# Altium project iMag1_2.PrjPcb
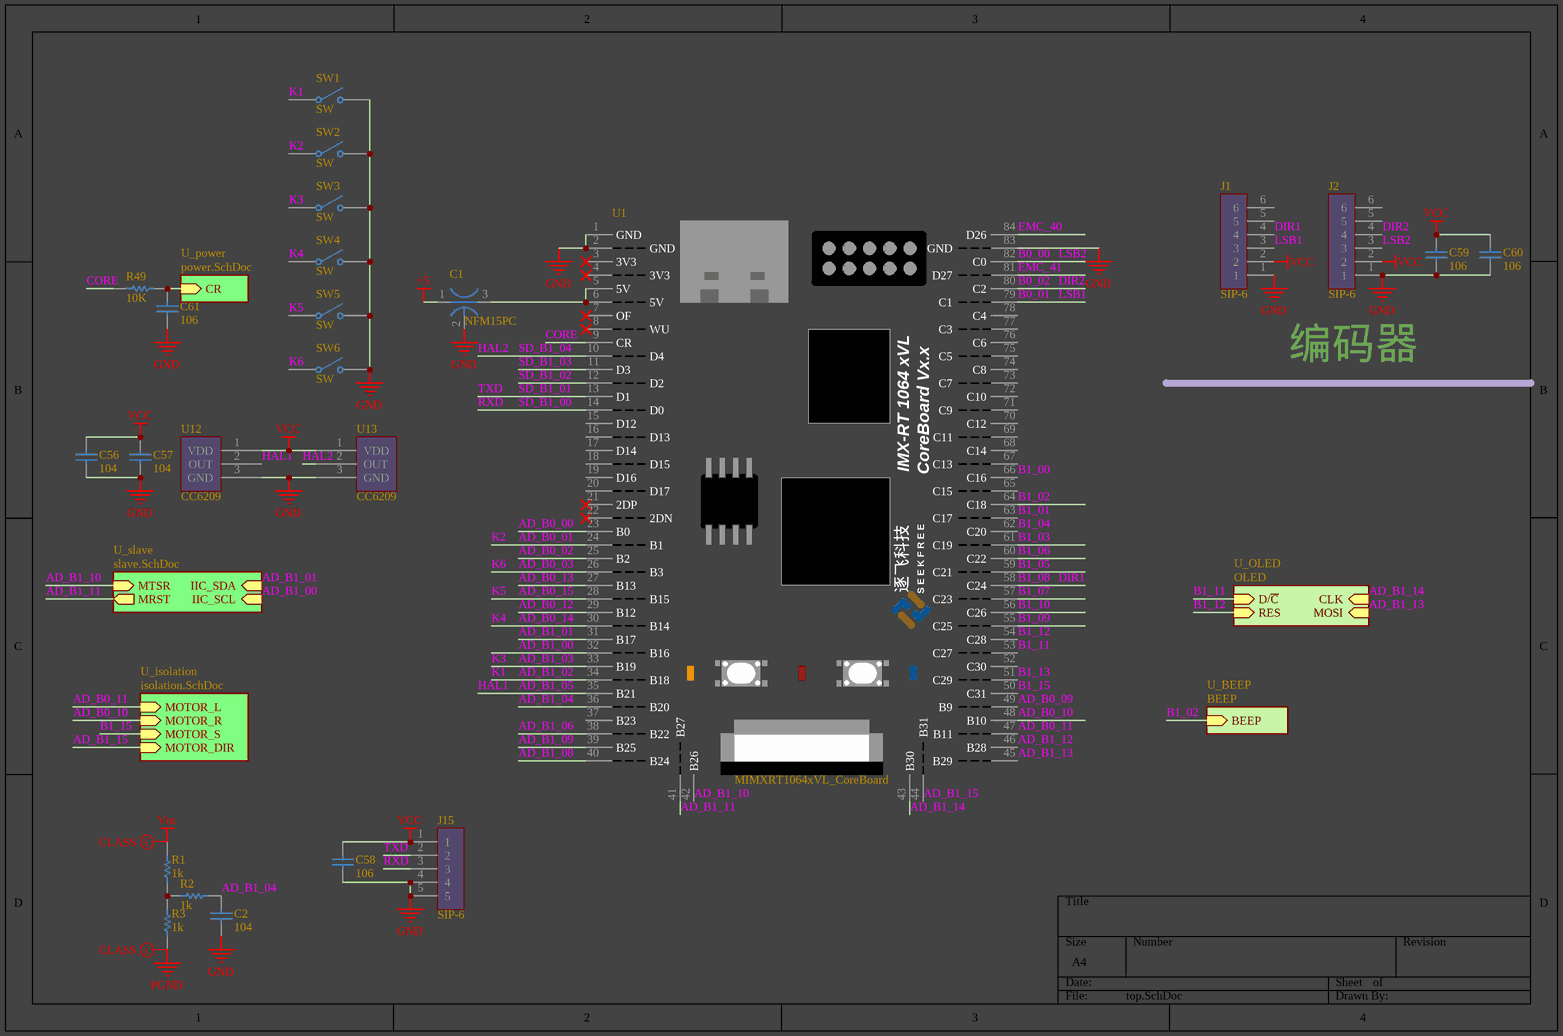
[diagram p0: top.SchDoc]
嘉立创: TRUE; 雕刻机: FALSE
5 sheets, 163 parts. Net scope: hierarchical (ports join the sheet entries above them; power ports are global).
Board file: pcb.PcbDoc
Sheets:
  top.SchDoc
    U_power = power.SchDoc
    U_slave = slave.SchDoc
      U_invert = invert.SchDoc
    U_isolation = isolation.SchDoc

## Sheet top.SchDoc
size A4; DocumentNumber: 1; SheetNumber: 1; SheetTotal: 9

### Parts
C1  NFM15PC  [FILTER-SMD_3P-L1.0-W0.5-L]
C2  104  [C0603]
C56  104  [C0603]
C57  104  [C0603]
C58  106  [C0603]
C59  106  [C0603]
C60  106  [C0603]
C61  106  [C0603]
J1  SIP-6  [2.54简易牛角座6P]
J2  SIP-6  [2.54简易牛角座6P]
J15  SIP-6  [2.54排针1X5]
R1  1k  [R0603]
R2  1k  [R0603]
R3  1k  [R0603]
R49  10K  [R0603]
SW1  SW  [KEY-SMD_4P-L4.2-W3.2-P2.20-LS4.6]
SW2  SW  [KEY-SMD_4P-L4.2-W3.2-P2.20-LS4.6]
SW3  SW  [KEY-SMD_4P-L4.2-W3.2-P2.20-LS4.6]
SW4  SW  [KEY-SMD_4P-L4.2-W3.2-P2.20-LS4.6]
SW5  SW  [KEY-SMD_4P-L4.2-W3.2-P2.20-LS4.6]
SW6  SW  [KEY-SMD_4P-L4.2-W3.2-P2.20-LS4.6]
U1  MIMXRT1064xVL_CoreBoard  [MIMXRT1064xVL_CoreBoard]
U12  CC6209  [SOT-23]
U13  CC6209  [SOT-23]

### Sub-sheets
U_BEEP = BEEP (file not in this document): BEEP (in)
U_isolation = isolation.SchDoc: MOTOR_L (in), MOTOR_R (in), MOTOR_S (in), MOTOR_DIR (in)
U_OLED = OLED (file not in this document): D/~{C} (in), RES (in), CLK (in), MOSI (in)
U_power = power.SchDoc: CR (in)
U_slave = slave.SchDoc: MTSR (in), MRST (out), IIC_SDA (in), IIC_SCL (in)

### Nets
+5: C1.1(IN)
GND: C1.2(GND) C2.1 C56.1 C57.1 C58.1 C59.1 C60.1 C61.1 J1.1 J2.1 J15.4 J15.5 SW1.2(NO) SW2.2(NO) SW3.2(NO) SW4.2(NO) SW5.2(NO) SW6.2(NO) U1.1(GND) U1.2(GND) U1.83(GND) U12.3(GND) U13.3(GND)
PGND: R3.1
VCC: C56.2 C57.2 C58.2 C59.2 C60.2 J1.2 J2.2 J15.1 U12.1(VDD) U13.1(VDD)
Vm: R1.2
AD_B0_00: U1.23(B0)
AD_B0_01: SW2.1(COMMON) U1.24(B1)  [also labelled K2]
AD_B0_02: U1.25(B2)
AD_B0_03: SW6.1(COMMON) U1.26(B3)  [also labelled K6]
AD_B0_09: U1.49(B9)
AD_B0_10: U1.48(B10) ; sheet U_isolation/MOTOR_R
AD_B0_11: U1.47(B11) ; sheet U_isolation/MOTOR_L
AD_B0_12: U1.29(B12)
AD_B0_13: U1.27(B13)
AD_B0_14: SW4.1(COMMON) U1.30(B14)  [also labelled K4]
AD_B0_15: SW5.1(COMMON) U1.28(B15)  [also labelled K5]
AD_B1_00: U1.32(B16) ; sheet U_slave/IIC_SCL
AD_B1_01: U1.31(B17) ; sheet U_slave/IIC_SDA
AD_B1_02: SW1.1(COMMON) U1.34(B18)  [also labelled K1]
AD_B1_03: SW3.1(COMMON) U1.33(B19)  [also labelled K3]
AD_B1_04: C2.2 R2.1 U1.36(B20)
AD_B1_05: U1.35(B21) U12.2(OUT)  [also labelled HAL1]
AD_B1_06: U1.38(B22)
AD_B1_08: U1.40(B24)
AD_B1_09: U1.39(B25)
AD_B1_10: U1.42(B26) ; sheet U_slave/MTSR
AD_B1_11: U1.41(B27) ; sheet U_slave/MRST
AD_B1_12: U1.46(B28)
AD_B1_13: U1.45(B29) ; sheet U_OLED/MOSI
AD_B1_14: U1.43(B30) ; sheet U_OLED/CLK
AD_B1_15: U1.44(B31) ; sheet U_isolation/MOTOR_DIR
B0_00: J2.3 U1.82(C0)  [also labelled LSB2]
B0_01: J1.3 U1.79(C1)  [also labelled LSB1]
B0_02: J2.4 U1.80(C2)  [also labelled DIR2]
B1_00: U1.66(C16)
B1_01: U1.63(C17)
B1_02: U1.64(C18) ; sheet U_BEEP/BEEP
B1_03: U1.61(C19)
B1_04: U1.62(C20)
B1_05: U1.59(C21)
B1_06: U1.60(C22)
B1_07: U1.57(C23)
B1_08: J1.4 U1.58(C24)  [also labelled DIR1]
B1_09: U1.55(C25)
B1_10: U1.56(C26)
B1_11: U1.53(C27) ; sheet U_OLED/D/~{C}
B1_12: U1.54(C28) ; sheet U_OLED/RES
B1_13: U1.51(C29)
B1_15: U1.50(C31) ; sheet U_isolation/MOTOR_S
CORE: R49.2 U1.9(CR)
CR: C61.2 R49.1 ; sheet U_power/CR
EMC_40: U1.84(D26)
EMC_41: U1.81(D27)
HAL2: U1.10(D4) U13.2(OUT)  [also labelled SD_B1_04]
RXD: J15.3 U1.14(D0)  [also labelled SD_B1_00]
SD_B1_01: J15.2 U1.13(D1)  [also labelled TXD]
SD_B1_02: U1.12(D2)
SD_B1_03: U1.11(D3)
NetC1_3: C1.3(OUT) U1.5(5V) U1.6(5V)
NetR1_1: R1.1 R2.2 R3.2

Not connected (* = marked no-connect by the designer): J1 5 6; J2 5 6; U1 3(3V3)* 4(3V3)* 7(OF)* 8(WU)* 15(D12) 16(D13) 17(D14) 18(D15) 19(D16) 20(D17) 21(2DP)* 22(2DN)* 37(B23) 52(C30) 65(C15) 67(C13) 68(C14) 69(C11) 70(C12) 71(C9) 72(C10) 73(C7) 74(C8) 75(C5) 76(C6) 77(C3) 78(C4)

### Layout directives
net class POW: Vm
net class GND: PGND

### Notes on the sheet
- 编码器
- Title
- Size:
- Date:
- A4
- Number:
- Time:
- Revision:
- Sheet
- of
- File:
- (in symbol MIMXRT1064xVL_CoreBoard) IMX-RT 1064 xVL; CoreBoard Vx.x; 逐飞科技; S E E K F R E E

### Library data of the parts
C1 = 陶瓷滤波器: BOM_Manufacturer: Murata Electronics; BOM_Manufacturer Part: NFM15PC473C1C3D; Capacitance: 47nF; Contributor: LCSC; BOM_Supplier: LCSC; BOM_Supplier Part: C162672; spicePre: U; spiceSymbolName: NFM15PC473C1C3D
C2 C56-C61 = 电容: Capacitor; Value: 22pF; Published: 8-Jun-2000; LatestRevisionDate: 17-Jul-2002; LatestRevisionNote: Re-released for DXP Platform.; PackageReference: RAD-0.3; Publisher: Altium Limited; PackageDescription: Radial Cap, Thru-Hole; 2 Leads; 0.3 in Pin Spacing
J15 = SIP-5
R1-R3 R49 = 电阻: Resistor; Value: 150R; Published: 8-Jun-2000; LatestRevisionDate: 17-Jul-2002; LatestRevisionNote: Re-released for DXP Platform.; PackageReference: AXIAL-0.3; Publisher: Altium Limited; PackageDescription: Axial Device, Thru-Hole; 2 Leads; 0.3 in Pin Spacing
SW1-SW6 = Switch: Single-Pole, Single-Throw Switch
U1 = MIMXRT1064xVL_CoreBoard: 逐飞科技i.MX RT1064核心板整体原理，可直接使用
U12 U13 = 霍尔开关

## Sheet power.SchDoc
size A4; DocumentNumber: 3; SheetNumber: 3; SheetTotal: 9
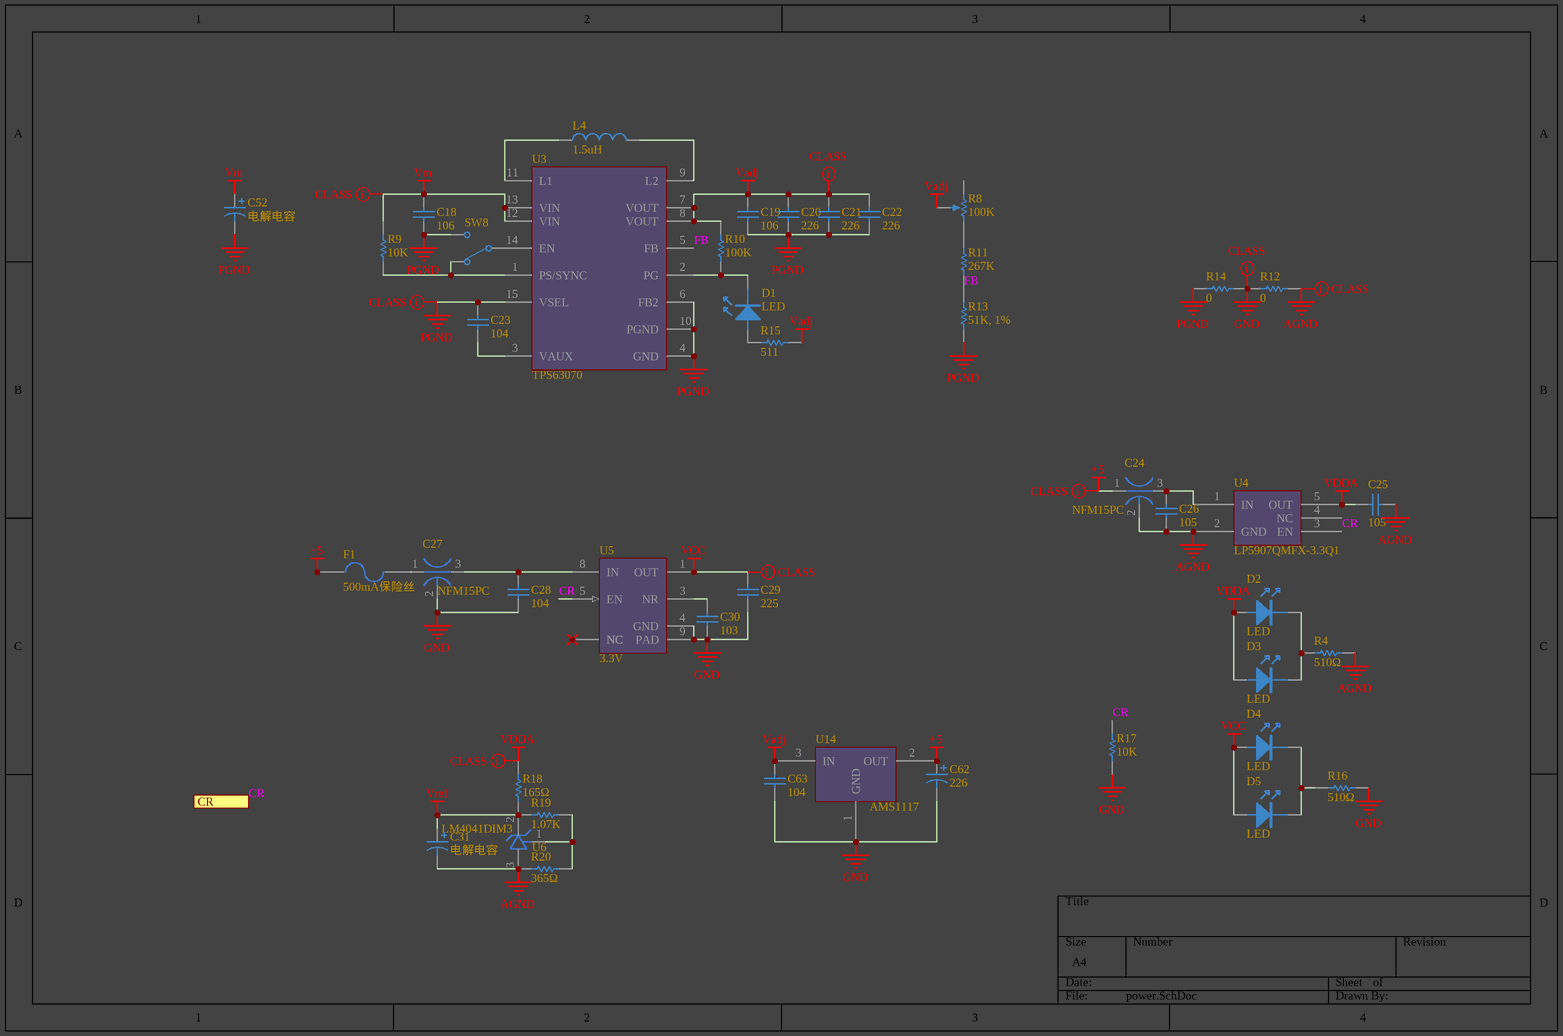
[diagram p1: power.SchDoc]

### Parts
C18  106  [C0603]
C19  106  [C0603]
C20  226  [0805C]
C21  226  [0805C]
C22  226  [0805C]
C23  104  [C0402]
C24  NFM15PC  [FILTER-SMD_3P-L1.0-W0.5-L]
C25  105  [C0603]
C26  105  [C0603]
C27  NFM15PC  [FILTER-SMD_3P-L1.0-W0.5-L]
C28  104  [C0402]
C29  225  [C0603]
C30  103  [C0402]
C31  电解电容  [3216-ce]
C52  电解电容  [贴片电解 6.3*5.4]
C62  226  [3216-ce]
C63  104  [C0603]
D1  LED  [LED 0603R]
D2  LED  [LED-SMD_L1.7-W0.6-RD]
D3  LED  [LED-SMD_L1.7-W0.6-RD]
D4  LED  [LED-SMD_L1.7-W0.6-RD]
D5  LED  [LED-SMD_L1.7-W0.6-RD]
F1  500mA保险丝  [FUSE-1210]
L4  1.5uH  [L5X5]
R4  510Ω  [R0402]
R8  100K  [3296W]
R9  10K  [R0402]
R10  100K  [R0402]
R11  267K  [R0402]
R12  0  [R0603]
R13  51K, 1%  [R0402]
R14  0  [R0603]
R15  511  [R0402]
R16  510Ω  [R0402]
R17  10K  [R0603]
R18  165Ω  [R0402]
R19  1.07K  [R0402]
R20  365Ω  [R0402]
SW8  K3-1235S-K1  [K3-1235S-K1]  (value not drawn)
U3  TPS63070  [VQFN-15]
U4  LP5907QMFX-3.3Q1  [SOT-23-5]
U5  3.3V  [VSON-8]
U6  LM4041DIM3  [SOT-23]
U14  AMS1117  [AMS1117]

### Ports
CR (in)

### Nets
+5: C24.1(IN) C62.1 F1.1 U14.2(OUT)
AGND: C24.2(GND) C25.1 C26.1 C31.2 R4.1 R12.1 R20.2 U4.2(GND) U6.3(A)
GND: C27.2(GND) C28.1 C29.1 C30.1 C62.2 C63.1 R12.2 R14.1 R16.1 R17.2 U5.4(GND) U5.9(PAD) U14.1(GND)
PGND: C18.2 C19.1 C20.1 C21.1 C22.1 C23.2 C52.2 R13.2 R14.2 SW8.3 U3.4(GND) U3.6(FB2) U3.10(PGND) U3.15(VSEL)
Vadj: C19.2 C20.2 C21.2 C22.2 C63.2 R8.2(TAP) R10.2 R15.1 U3.7(VOUT) U3.8(VOUT) U14.3(IN)
VCC: C29.2 D4.A D5.A U5.1(OUT)
VDDA: C25.2 D2.A D3.A R18.2 U4.5(OUT)
Vm: C18.1 C52.1 R9.1 U3.12(VIN) U3.13(VIN)
Vref: C31.1 R18.1 R19.2 U6.2(K)
CR: R17.1 U4.3(EN) U5.5(EN) ; port CR
FB: R11.2 R13.1 U3.5(FB)
NetC23_1: C23.1 U3.3(VAUX)
NetC24_3: C24.3(OUT) C26.2 U4.1(IN)
NetC27_1: C27.1(IN) F1.2
NetC27_3: C27.3(OUT) C28.2 U5.8(IN)
NetC30_2: C30.2 U5.3(NR)
NetD1_A: D1.A R15.2
NetD1_K: D1.K R10.1 U3.2(PG)
NetD2_K: D2.K D3.K R4.2
NetD4_K: D4.K D5.K R16.2
NetL4_1: L4.1 U3.11(L1)
NetL4_2: L4.2 U3.9(L2)
NetR8_3: R8.3(BOT) R11.1
NetR9_2: R9.2 SW8.1 U3.1(PS/SYNC)
NetR19_1: R19.1 R20.1 U6.1(R)
NetSW8_2: SW8.2 U3.14(EN)
NetU5_2: U5.2(NC) U5.6(NC) U5.7(NC)

Not connected (* = marked no-connect by the designer): R8 1(TOP); U4 4(NC)

### Layout directives
net class GND: AGND, GND, PGND
net class POW: +5, Vadj, VCC, VDDA, Vm

### Library data of the parts
C18-C23 C25 C26 C28-C30 C63 = 电容: Capacitor; Value: 22pF; Published: 8-Jun-2000; LatestRevisionDate: 17-Jul-2002; LatestRevisionNote: Re-released for DXP Platform.; PackageReference: RAD-0.3; Publisher: Altium Limited; PackageDescription: Radial Cap, Thru-Hole; 2 Leads; 0.3 in Pin Spacing
C24 C27 = 陶瓷滤波器: as C1 on sheet top; BOM_Supplier: LCSC; BOM_Supplier Part: C162672; spicePre: U; spiceSymbolName: NFM15PC473C1C3D
C31 C52 C62 = 电解电容: Polarized Capacitor (Axial); Value: 100pF; Published: 8-Jun-2000; LatestRevisionDate: 17-Jul-2002; LatestRevisionNote: Re-released for DXP Platform.; PackageReference: POLAR0.8; Publisher: Altium Limited; PackageDescription: Polarized Capacitor; 2 Leads
F1 = 保险丝: 500mA保险丝  1210; Published: 8-Jun-2000; LatestRevisionDate: 17-Jul-2002; LatestRevisionNote: Re-released for DXP Platform.; PackageReference: PIN-W2/E2.8; Publisher: Altium Limited; PackageDescription: Thru-Hole; 2 Leads
L4 = 电感
R4 R9-R20 = 电阻: Resistor; Value: 150R; Published: 8-Jun-2000; LatestRevisionDate: 17-Jul-2002; LatestRevisionNote: Re-released for DXP Platform.; PackageReference: AXIAL-0.3; Publisher: Altium Limited; PackageDescription: Axial Device, Thru-Hole; 2 Leads; 0.3 in Pin Spacing
R8 = 电位器
SW8 = 单刀双掷: Switch
U4 = 线性稳压-5脚
U5 = TPS73512DRBR: No Description Available; Alternate_PartNumber: TPS73512DRBT; Manufacturer: Texas Instruments; CompType: IC; PIN_COUNT: 9; Application_BuildNumber: *; PartNumber: TPS73512DRBR; PackageReference: DRB0008A; MountType: SMT; RoHS: Y; RefDes: RefDes; Type: DEV; Value: Value; Copyright: Copyright (C) 2018 Accelerated Designs. All rights reserved
U6 = 电压基准: BOM_Manufacturer: PJ(Pingjingsemi); BOM_Manufacturer Part: TL431; Contributor: LCSC; SMT Type: Extend; BOM_Supplier: LCSC; BOM_Supplier Part: C411752; BOM_LCSC Assembly: Yes; spicePre: U; spiceSymbolName: TL431_C411752
U14 = 三端稳压

## Sheet slave.SchDoc
size A3; DocumentNumber: 4; SheetNumber: 4; SheetTotal: 9
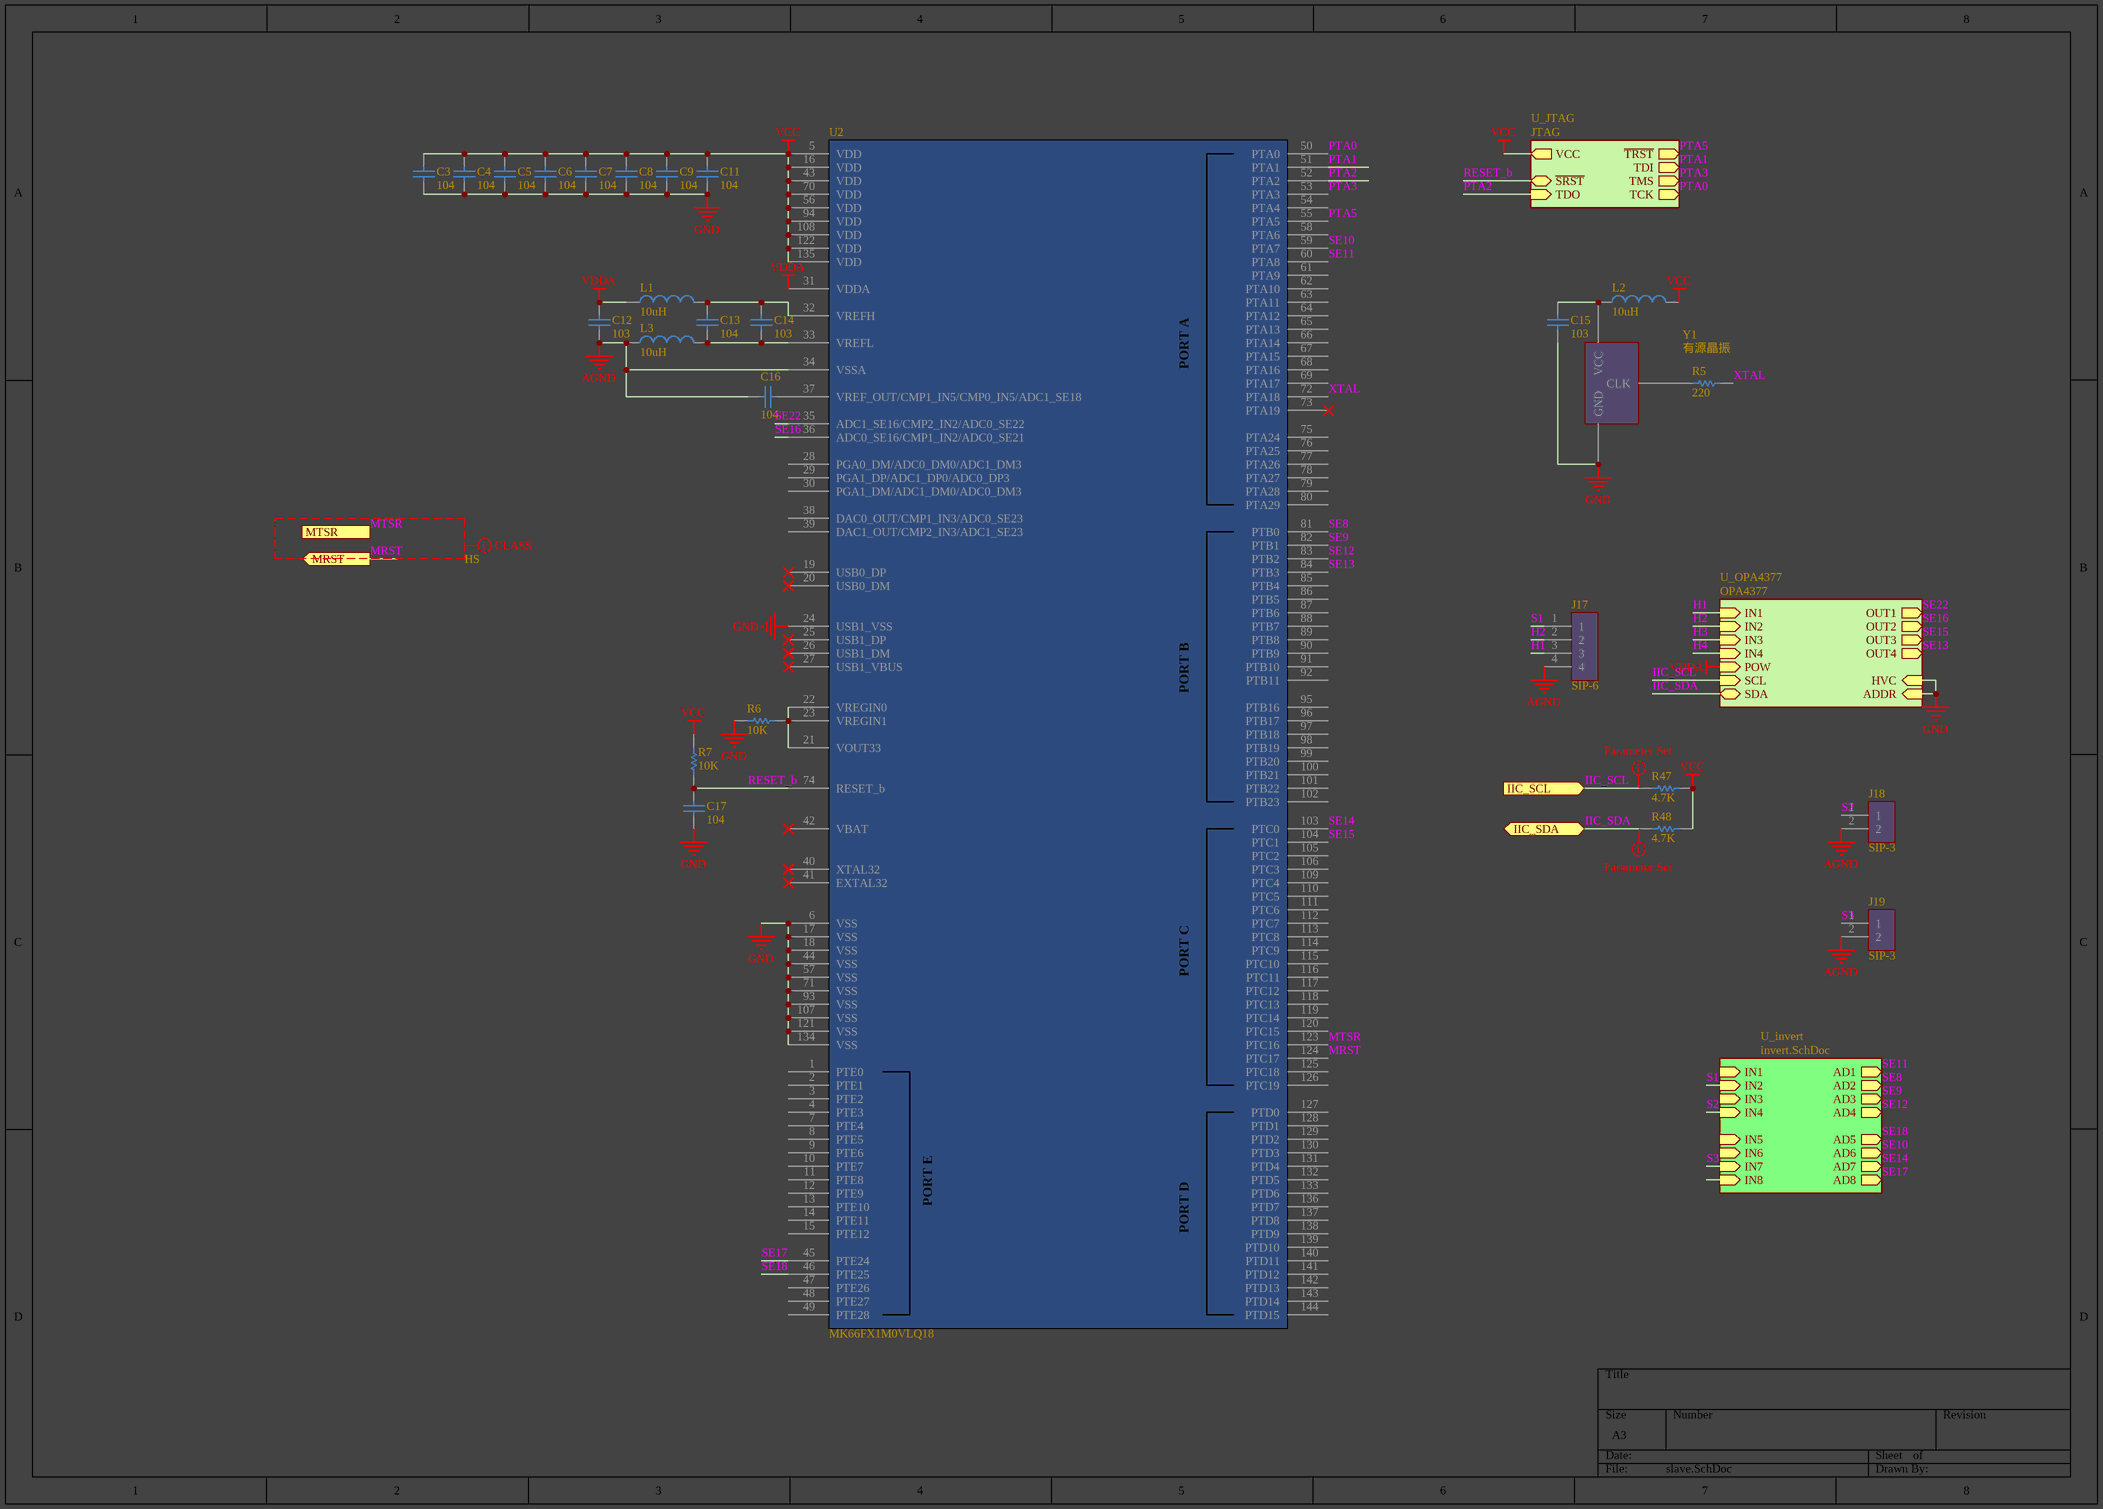
[diagram p2: slave.SchDoc]

### Parts
C3  104  [C0603]
C4  104  [C0603]
C5  104  [C0603]
C6  104  [C0603]
C7  104  [C0603]
C8  104  [C0603]
C9  104  [C0603]
C11  104  [C0603]
C12  103  [C0603]
C13  104  [C0603]
C14  103  [C0603]
C15  103  [C0603]
C16  104  [C0402]
C17  104  [C0603]
J17  SIP-6  [2.0排针4P]
J18  SIP-3  [GH1.25-2P]
J19  SIP-3  [GH1.25-2P]
L1  10uH  [L0603]
L2  10uH  [L0603]
L3  10uH  [L0603]
R5  220  [R0402]
R6  10K  [R0603]
R7  10K  [R0603]
R47  4.7K  [R0603]
R48  4.7K  [R0603]
U2  MK66FX1M0VLQ18  [LQFP144 20X20]
Y1  有源晶振  [OSC 5032-4P]

### Sub-sheets
U_invert = invert.SchDoc: AD1 (out), AD2 (out), AD3 (out), AD4 (out), AD5 (out), AD6 (out), AD7 (out), AD8 (out), IN8 (in), IN7 (in), IN6 (in), IN5 (in), IN4 (in), IN3 (in), IN2 (in), IN1 (in)
U_JTAG = JTAG (file not in this document): TDO (in), ~{SRST} (bidir), ~{TRST} (out), TDI (out), TMS (out), TCK (out), VCC (out)
U_OPA4377 = OPA4377 (file not in this document): IN1 (in), IN2 (in), IN3 (in), IN4 (in), OUT1 (out), OUT2 (out), OUT3 (out), OUT4 (out), POW (in), SCL (in), SDA (bidir), ADDR (in), HVC (in)

### Ports
IIC_SCL (in), IIC_SDA (bidir), MRST (out), MTSR (in)

### Nets
AGND: C12.1 C16.1 J17.4 J18.2 J19.2 L3.1 U2.34(VSSA)
GND: C3.1 C4.1 C5.1 C6.1 C7.1 C8.1 C9.1 C11.1 C15.1 C17.1 R6.2 U2.6(VSS) U2.17(VSS) U2.18(VSS) U2.24(USB1_VSS) U2.44(VSS) U2.57(VSS) U2.71(VSS) U2.93(VSS) U2.107(VSS) U2.121(VSS) U2.134(VSS) Y1.2(GND) ; sheet U_OPA4377/ADDR, sheet U_OPA4377/HVC
VCC: C3.2 C4.2 C5.2 C6.2 C7.2 C8.2 C9.2 C11.2 L2.2 R7.2 R47.1 R48.1 U2.5(VDD) U2.16(VDD) U2.43(VDD) U2.56(VDD) U2.70(VDD) U2.94(VDD) U2.108(VDD) U2.122(VDD) U2.135(VDD) ; sheet U_JTAG/VCC
VDDA: C12.2 L1.1 U2.31(VDDA) ; sheet U_OPA4377/POW
H1: J17.3 ; sheet U_OPA4377/IN1
H2: J17.2 ; sheet U_OPA4377/IN2
H3: sheet U_OPA4377/IN3
H4: sheet U_OPA4377/IN4
IIC_SCL: R47.2 ; port IIC_SCL, sheet U_OPA4377/SCL  [project net AD_B1_00]
IIC_SDA: R48.2 ; port IIC_SDA, sheet U_OPA4377/SDA  [project net AD_B1_01]
MRST: U2.124(PTC17) ; port MRST  [project net AD_B1_11]
MTSR: U2.123(PTC16) ; port MTSR  [project net AD_B1_10]
PTA0: U2.50(PTA0) ; sheet U_JTAG/TCK
PTA1: U2.51(PTA1) ; sheet U_JTAG/TDI
PTA2: U2.52(PTA2) ; sheet U_JTAG/TDO
PTA3: U2.53(PTA3) ; sheet U_JTAG/TMS
PTA5: U2.55(PTA5) ; sheet U_JTAG/~{TRST}
RESET_b: C17.2 R7.1 U2.74(RESET_b) ; sheet U_JTAG/~{SRST}
S1: J17.1 ; sheet U_invert/IN2
S2: J18.1 ; sheet U_invert/IN4
S3: J19.1 ; sheet U_invert/IN7
SE8: U2.81(PTB0) ; sheet U_invert/AD2
SE9: U2.82(PTB1) ; sheet U_invert/AD3
SE10: U2.59(PTA7) ; sheet U_invert/AD6
SE11: U2.60(PTA8) ; sheet U_invert/AD1
SE12: U2.83(PTB2) ; sheet U_invert/AD4
SE13: U2.84(PTB3) ; sheet U_OPA4377/OUT4
SE14: U2.103(PTC0) ; sheet U_invert/AD7
SE15: U2.104(PTC1) ; sheet U_OPA4377/OUT3
SE16: U2.36(ADC0_SE16/CMP1_IN2/ADC0_SE21) ; sheet U_OPA4377/OUT2
SE17: U2.45(PTE24) ; sheet U_invert/AD8
SE18: U2.46(PTE25) ; sheet U_invert/AD5
SE22: U2.35(ADC1_SE16/CMP2_IN2/ADC0_SE22) ; sheet U_OPA4377/OUT1
XTAL: R5.1 U2.72(PTA18)
NetC13_1: C13.1 C14.1 L3.2 U2.33(VREFL)
NetC13_2: C13.2 C14.2 L1.2 U2.32(VREFH)
NetC15_2: C15.2 L2.1 Y1.4(VCC)
NetC16_2: C16.2 U2.37(VREF_OUT/CMP1_IN5/CMP0_IN5/ADC1_SE18)
NetR5_2: R5.2 Y1.3(CLK)
NetR6_1: R6.1 U2.21(VOUT33) U2.22(VREGIN0) U2.23(VREGIN1)

Not connected (* = marked no-connect by the designer): U2 1(PTE0) 2(PTE1) 3(PTE2) 4(PTE3) 7(PTE4) 8(PTE5) 9(PTE6) 10(PTE7) 11(PTE8) 12(PTE9) 13(PTE10) 14(PTE11) 15(PTE12) 19(USB0_DP)* 20(USB0_DM)* 25(USB1_DP)* 26(USB1_DM)* 27(USB1_VBUS)* 28(PGA0_DM/ADC0_DM0/ADC1_DM3) 29(PGA1_DP/ADC1_DP0/ADC0_DP3) 30(PGA1_DM/ADC1_DM0/ADC0_DM3) 38(DAC0_OUT/CMP1_IN3/ADC0_SE23) 39(DAC1_OUT/CMP2_IN3/ADC1_SE23) 40(XTAL32)* 41(EXTAL32)* 42(VBAT)* 47(PTE26) 48(PTE27) 49(PTE28) 54(PTA4) 58(PTA6) 61(PTA9) 62(PTA10) 63(PTA11) 64(PTA12) 65(PTA13) 66(PTA14) 67(PTA15) 68(PTA16) 69(PTA17) 73(PTA19)* 75(PTA24) 76(PTA25) 77(PTA26) 78(PTA27) 79(PTA28) 80(PTA29) 85(PTB4) 86(PTB5) 87(PTB6) 88(PTB7) 89(PTB8) 90(PTB9) 91(PTB10) 92(PTB11) 95(PTB16) 96(PTB17) 97(PTB18) 98(PTB19) 99(PTB20) 100(PTB21) 101(PTB22) 102(PTB23) 105(PTC2) 106(PTC3) 109(PTC4) 110(PTC5) 111(PTC6) 112(PTC7) 113(PTC8) 114(PTC9) 115(PTC10) 116(PTC11) 117(PTC12) 118(PTC13) 119(PTC14) 120(PTC15) 125(PTC18) 126(PTC19) 127(PTD0) 128(PTD1) 129(PTD2) 130(PTD3) 131(PTD4) 132(PTD5) 133(PTD6) 136(PTD7) 137(PTD8) 138(PTD9) 139(PTD10) 140(PTD11) 141(PTD12) 142(PTD13) 143(PTD14) 144(PTD15)

### Layout directives
net class HS: AD_B1_00, AD_B1_01, MRST, MTSR

### Notes on the sheet
- (in symbol MK66) PORT A; PORT B; PORT C; PORT E; PORT D

### Library data of the parts
C3-C9 C11-C17 = 电容: Capacitor; Value: 22pF; Published: 8-Jun-2000; LatestRevisionDate: 17-Jul-2002; LatestRevisionNote: Re-released for DXP Platform.; PackageReference: RAD-0.3; Publisher: Altium Limited; PackageDescription: Radial Cap, Thru-Hole; 2 Leads; 0.3 in Pin Spacing
J17 = SIP-4
J18 J19 = SIP-2
L1-L3 = 电感
R5-R7 R47 R48 = 电阻: Resistor; Value: 150R; Published: 8-Jun-2000; LatestRevisionDate: 17-Jul-2002; LatestRevisionNote: Re-released for DXP Platform.; PackageReference: AXIAL-0.3; Publisher: Altium Limited; PackageDescription: Axial Device, Thru-Hole; 2 Leads; 0.3 in Pin Spacing
U2 = MK66

## Sheet invert.SchDoc
size A4; DocumentNumber: 5; SheetNumber: 5; SheetTotal: 9
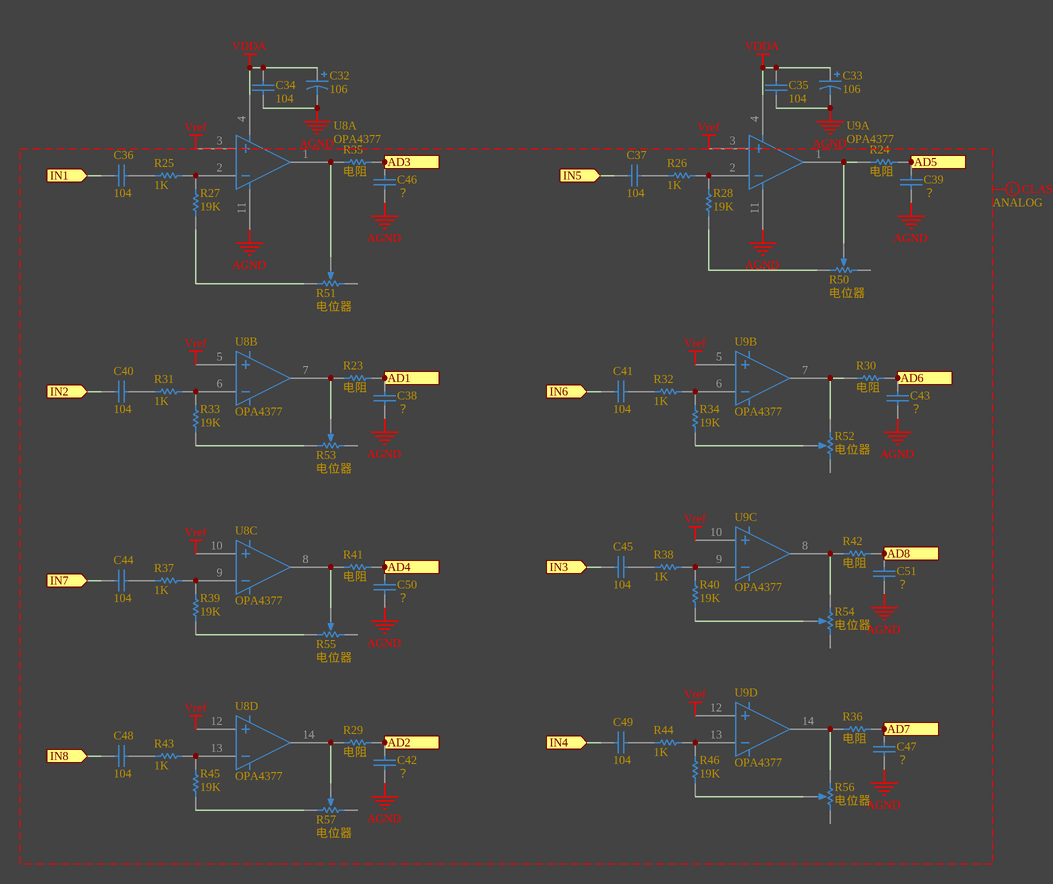
[diagram p3: invert.SchDoc]

### Parts
C32  106  [3216-ce]
C33  106  [3216-ce]
C34  104  [C0402]
C35  104  [C0402]
C36  104  [C0402]
C37  104  [C0402]
C38  ？  [C0402]
C39  ？  [C0402]
C40  104  [C0402]
C41  104  [C0402]
C42  ？  [C0402]
C43  ？  [C0402]
C44  104  [C0402]
C45  104  [C0402]
C46  ？  [C0402]
C47  ？  [C0402]
C48  104  [C0402]
C49  104  [C0402]
C50  ？  [C0402]
C51  ？  [C0402]
R23  电阻  [R0402]
R24  电阻  [R0402]
R25  1K  [R0402]
R26  1K  [R0402]
R27  19K  [R0402]
R28  19K  [R0402]
R29  电阻  [R0402]
R30  电阻  [R0402]
R31  1K  [R0402]
R32  1K  [R0402]
R33  19K  [R0402]
R34  19K  [R0402]
R35  电阻  [R0402]
R36  电阻  [R0402]
R37  1K  [R0402]
R38  1K  [R0402]
R39  19K  [R0402]
R40  19K  [R0402]
R41  电阻  [R0402]
R42  电阻  [R0402]
R43  1K  [R0402]
R44  1K  [R0402]
R45  19K  [R0402]
R46  19K  [R0402]
R50  电位器  [3296W]
R51  电位器  [3296W]
R52  电位器  [3296W]
R53  电位器  [3296W]
R54  电位器  [3296W]
R55  电位器  [3296W]
R56  电位器  [3296W]
R57  电位器  [3296W]
U8  OPA4377  [TSSOP-14]  (parts A,B,C,D of 4)
U9  OPA4377  [TSSOP-14]  (parts A,B,C,D of 4)

### Ports
AD1 (out), AD2 (out), AD3 (out), AD4 (out), AD5 (out), AD6 (out), AD7 (out), AD8 (out), IN1 (in), IN2 (in), IN3 (in), IN4 (in), IN5 (in), IN6 (in), IN7 (in), IN8 (in)

### Nets
AGND: C32.2 C33.2 C34.1 C35.1 C38.1 C39.1 C42.1 C43.1 C46.1 C47.1 C50.1 C51.1 U8.11 U9.11
VDDA: C32.1 C33.1 C34.2 C35.2 U8.4 U9.4
Vref: U8.3 U8.5 U8.10 U8.12 U9.3 U9.5 U9.10 U9.12
S1: C40.1 ; port IN2
S2: C49.1 ; port IN4
S3: C44.1 ; port IN7
SE8: C42.2 R29.1 ; port AD2
SE9: C46.2 R35.1 ; port AD3
SE10: C43.2 R30.1 ; port AD6
SE11: C38.2 R23.1 ; port AD1
SE12: C50.2 R41.1 ; port AD4
SE14: C47.2 R36.1 ; port AD7
SE17: C51.2 R42.1 ; port AD8
SE18: C39.2 R24.1 ; port AD5
NetC36_1: C36.1 ; port IN1
NetC36_2: C36.2 R25.2
NetC37_1: C37.1 ; port IN5
NetC37_2: C37.2 R26.2
NetC40_2: C40.2 R31.2
NetC41_1: C41.1 ; port IN6
NetC41_2: C41.2 R32.2
NetC44_2: C44.2 R37.2
NetC45_1: C45.1 ; port IN3
NetC45_2: C45.2 R38.2
NetC48_1: C48.1 ; port IN8
NetC48_2: C48.2 R43.2
NetC49_2: C49.2 R44.2
NetR23_2: R23.2 R53.2(TAP) U8.7
NetR24_2: R24.2 R50.2(TAP) U9.1
NetR25_1: R25.1 R27.1 U8.2
NetR26_1: R26.1 R28.1 U9.2
NetR27_2: R27.2 R51.3(BOT)
NetR28_2: R28.2 R50.3(BOT)
NetR29_2: R29.2 R57.2(TAP) U8.14
NetR30_2: R30.2 R52.1(TOP) U9.7
NetR31_1: R31.1 R33.1 U8.6
NetR32_1: R32.1 R34.1 U9.6
NetR33_2: R33.2 R53.3(BOT)
NetR34_2: R34.2 R52.2(TAP)
NetR35_2: R35.2 R51.2(TAP) U8.1
NetR36_2: R36.2 R56.1(TOP) U9.14
NetR37_1: R37.1 R39.1 U8.9
NetR38_1: R38.1 R40.1 U9.9
NetR39_2: R39.2 R55.3(BOT)
NetR40_2: R40.2 R54.2(TAP)
NetR41_2: R41.2 R55.2(TAP) U8.8
NetR42_2: R42.2 R54.1(TOP) U9.8
NetR43_1: R43.1 R45.1 U8.13
NetR44_1: R44.1 R46.1 U9.13
NetR45_2: R45.2 R57.3(BOT)
NetR46_2: R46.2 R56.2(TAP)

Not connected (* = marked no-connect by the designer): R50 1(TOP); R51 1(TOP); R52 3(BOT); R53 1(TOP); R54 3(BOT); R55 1(TOP); R56 3(BOT); R57 1(TOP)

### Layout directives
net class ANALOG: AGND, Vref

### Library data of the parts
C32 C33 = 电解电容: as C31 on sheet power; Published: 8-Jun-2000; LatestRevisionDate: 17-Jul-2002; LatestRevisionNote: Re-released for DXP Platform.; PackageReference: POLAR0.8; Publisher: Altium Limited; PackageDescription: Polarized Capacitor; 2 Leads
C34-C51 = 电容: Capacitor; Value: 22pF; Published: 8-Jun-2000; LatestRevisionDate: 17-Jul-2002; LatestRevisionNote: Re-released for DXP Platform.; PackageReference: RAD-0.3; Publisher: Altium Limited; PackageDescription: Radial Cap, Thru-Hole; 2 Leads; 0.3 in Pin Spacing
R23-R46 = 电阻: Resistor; Value: 150R; Published: 8-Jun-2000; LatestRevisionDate: 17-Jul-2002; LatestRevisionNote: Re-released for DXP Platform.; PackageReference: AXIAL-0.3; Publisher: Altium Limited; PackageDescription: Axial Device, Thru-Hole; 2 Leads; 0.3 in Pin Spacing
U8 U9 = 4运放

## Sheet isolation.SchDoc
size A4; DocumentNumber: 2; SheetNumber: 2; SheetTotal: 9
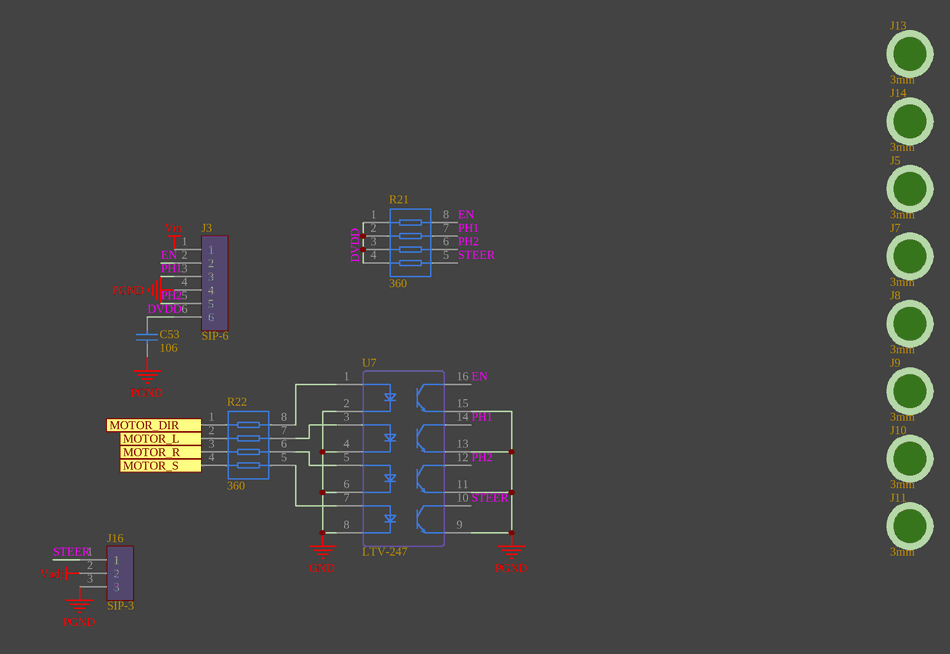
[diagram p4: isolation.SchDoc]

### Parts
C53  106  [C0603]
J3  SIP-6  [PH2.0-6_SMD]
J5  3mm  [定位孔 3mm]
J7  3mm  [定位孔 3mm]
J8  3mm  [定位孔 3mm]
J9  3mm  [定位孔 3mm]
J10  3mm  [定位孔 3mm]
J11  3mm  [定位孔 3mm]
J13  3mm  [定位孔 3mm]
J14  3mm  [定位孔 3mm]
J16  SIP-3  [2.54排针1X3]
R21  360  [0603_Rx4]
R22  360  [0603_Rx4]
U7  LTV-247  [WSOP-16]

### Ports
MOTOR_DIR (in), MOTOR_L (in), MOTOR_R (in), MOTOR_S (in)

### Nets
GND: U7.2(CAT1) U7.4(CAT2) U7.6(CAT3) U7.8(CAT4)
PGND: C53.1 J3.4 J16.3 U7.9(EM4) U7.11(EM3) U7.13(EM2) U7.15(EM1)
Vadj: J16.2
Vm: J3.1
AD_B0_10: R22.3 ; port MOTOR_R
AD_B0_11: R22.2 ; port MOTOR_L
AD_B1_15: R22.1 ; port MOTOR_DIR
B1_15: R22.4 ; port MOTOR_S
DVDD: C53.2 J3.6 R21.1 R21.2 R21.3 R21.4
EN: J3.2 R21.8 U7.16(COL1)
PH1: J3.3 R21.7 U7.14(COL2)
PH2: J3.5 R21.6 U7.12(COL3)
STEER: J16.1 R21.5 U7.10(COL4)
NetR22_5: R22.5 U7.7(AN4)
NetR22_6: R22.6 U7.5(AN3)
NetR22_7: R22.7 U7.3(AN2)
NetR22_8: R22.8 U7.1(AN1)

### Library data of the parts
C53 = 电容: Capacitor; Value: 22pF; Published: 8-Jun-2000; LatestRevisionDate: 17-Jul-2002; LatestRevisionNote: Re-released for DXP Platform.; PackageReference: RAD-0.3; Publisher: Altium Limited; PackageDescription: Radial Cap, Thru-Hole; 2 Leads; 0.3 in Pin Spacing
J5 J7-J11 J13 J14 = 定位孔
R21 R22 = 贴片排阻*4: 贴片排阻; ComponentLink1Description: 供应商链接; ComponentLink1URL: http://www.szlcsc.com/product/details_20907.html; Package: 0603*4; Supplier: LC; SuppliersPartNumber: C20197
U7 = 4光耦: BOM_Manufacturer: LITEON; Contributor: LCSC; SMT Type: Extend; BOM_Supplier: LCSC; BOM_Manufacturer Part: LTV-247; BOM_Supplier Part: C115451; BOM_LCSC Assembly: Yes; spicePre: U; spiceSymbolName: LTV-247

## Nets that join several sheets
+5: top (C1.1), power (C24.1 C62.1 F1.1 U14.2)
AGND: power (9 pins), slave (7 pins), invert (14 pins)
GND: top (23 pins), power (13 pins), slave (23 pins), isolation (U7.2 U7.4 U7.6 U7.8)
PGND: top (R3.1), power (14 pins), isolation (7 pins)
Vadj: power (11 pins), isolation (J16.2)
VCC: top (10 pins), power (C29.2 D4.A D5.A U5.1), slave (21 pins)
VDDA: power (5 pins), slave (C12.2 L1.1 U2.31), invert (6 pins)
Vm: top (R1.2), power (5 pins), isolation (J3.1)
Vref: power (C31.1 R18.1 R19.2 U6.2), invert (8 pins)
AD_B0_10: top (U1.48), isolation (R22.3)
AD_B0_11: top (U1.47), isolation (R22.2)
AD_B1_00: top (U1.32), slave (R47.2)
AD_B1_01: top (U1.31), slave (R48.2)
AD_B1_10: top (U1.42), slave (U2.123)
AD_B1_11: top (U1.41), slave (U2.124)
AD_B1_15: top (U1.44), isolation (R22.1)
B1_15: top (U1.50), isolation (R22.4)
CR: top (C61.2 R49.1), power (R17.1 U4.3 U5.5)
S1: slave (J17.1), invert (C40.1)
S2: slave (J18.1), invert (C49.1)
S3: slave (J19.1), invert (C44.1)
SE8: slave (U2.81), invert (C42.2 R29.1)
SE9: slave (U2.82), invert (C46.2 R35.1)
SE10: slave (U2.59), invert (C43.2 R30.1)
SE11: slave (U2.60), invert (C38.2 R23.1)
SE12: slave (U2.83), invert (C50.2 R41.1)
SE14: slave (U2.103), invert (C47.2 R36.1)
SE17: slave (U2.45), invert (C51.2 R42.1)
SE18: slave (U2.46), invert (C39.2 R24.1)